# EasyEDA schematic Bravo-M6-LED Board.json

## Sheets
1 Bravo-M6-LED Board: TITLE: Bravo V1.0-M6-LED Board; REV: 1.1; Date: 2021-11-23; Sheet: 1/2; Drawn By: Kaveh Majidi (CONFIG IOI)
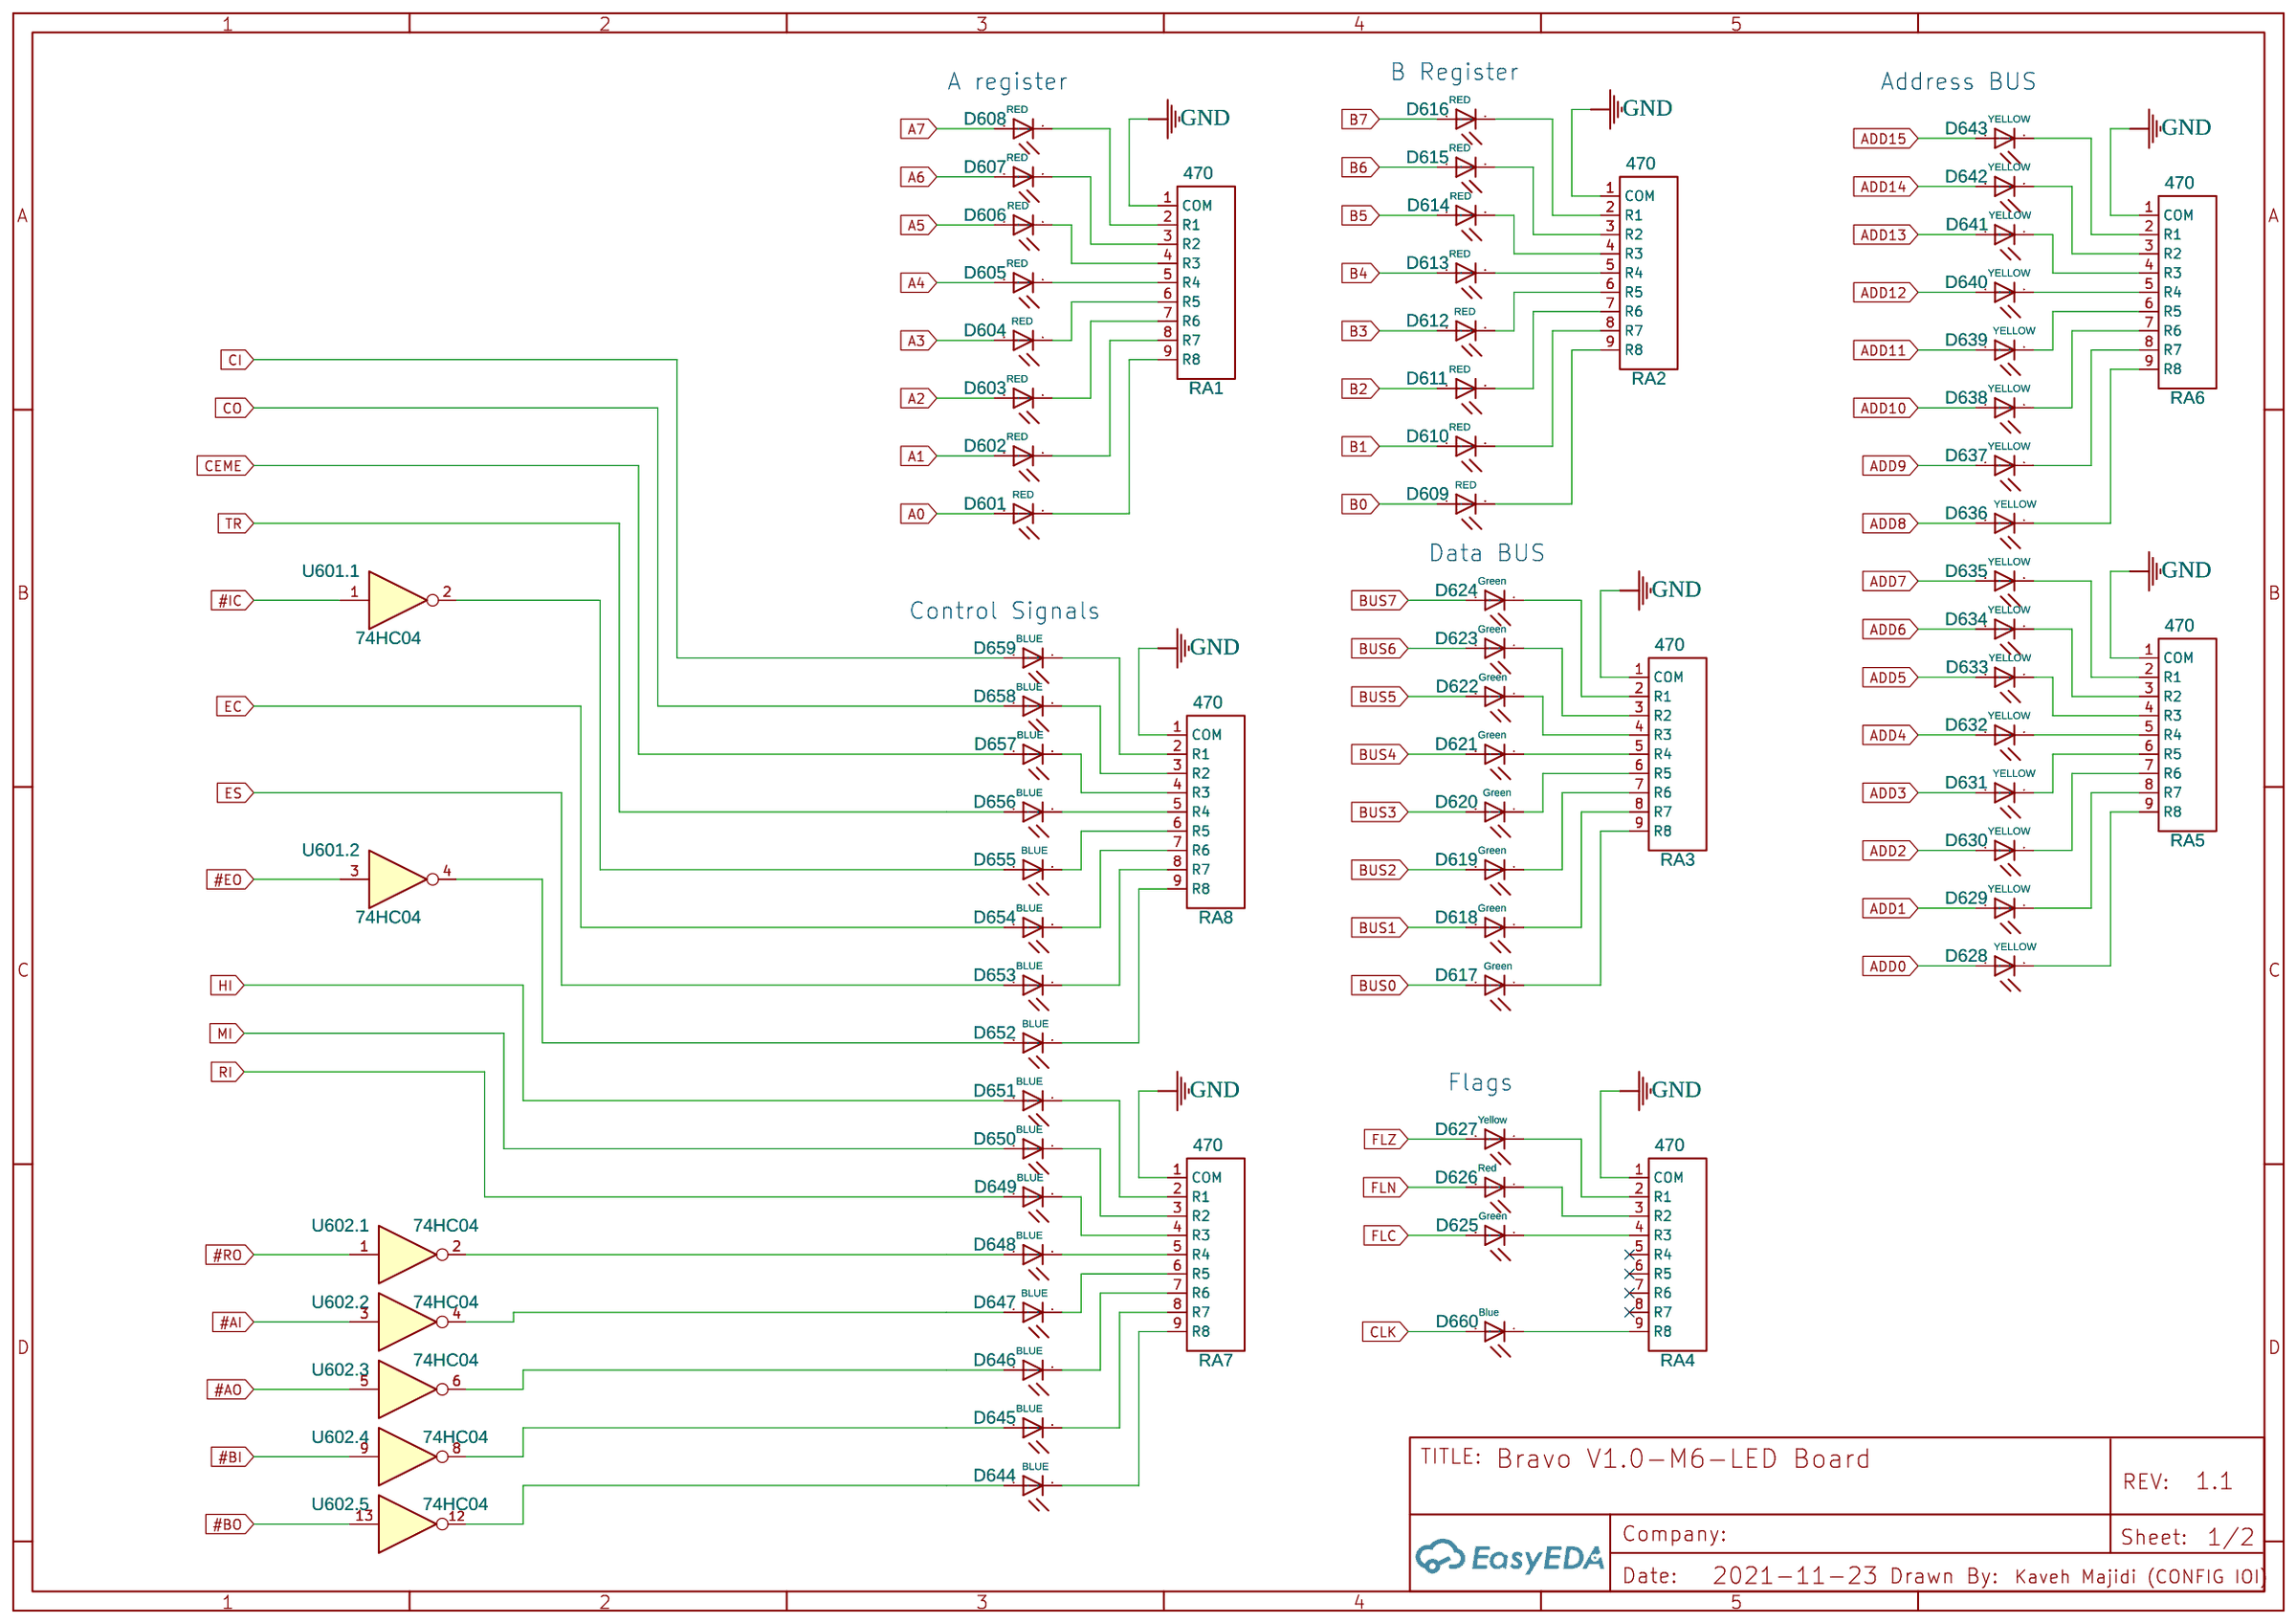
[diagram p0: Bravo-M6-LED Board]
2 Bravo-M6-Common: TITLE: Bravo V1.0-M6-Common; Sheet: 2/2
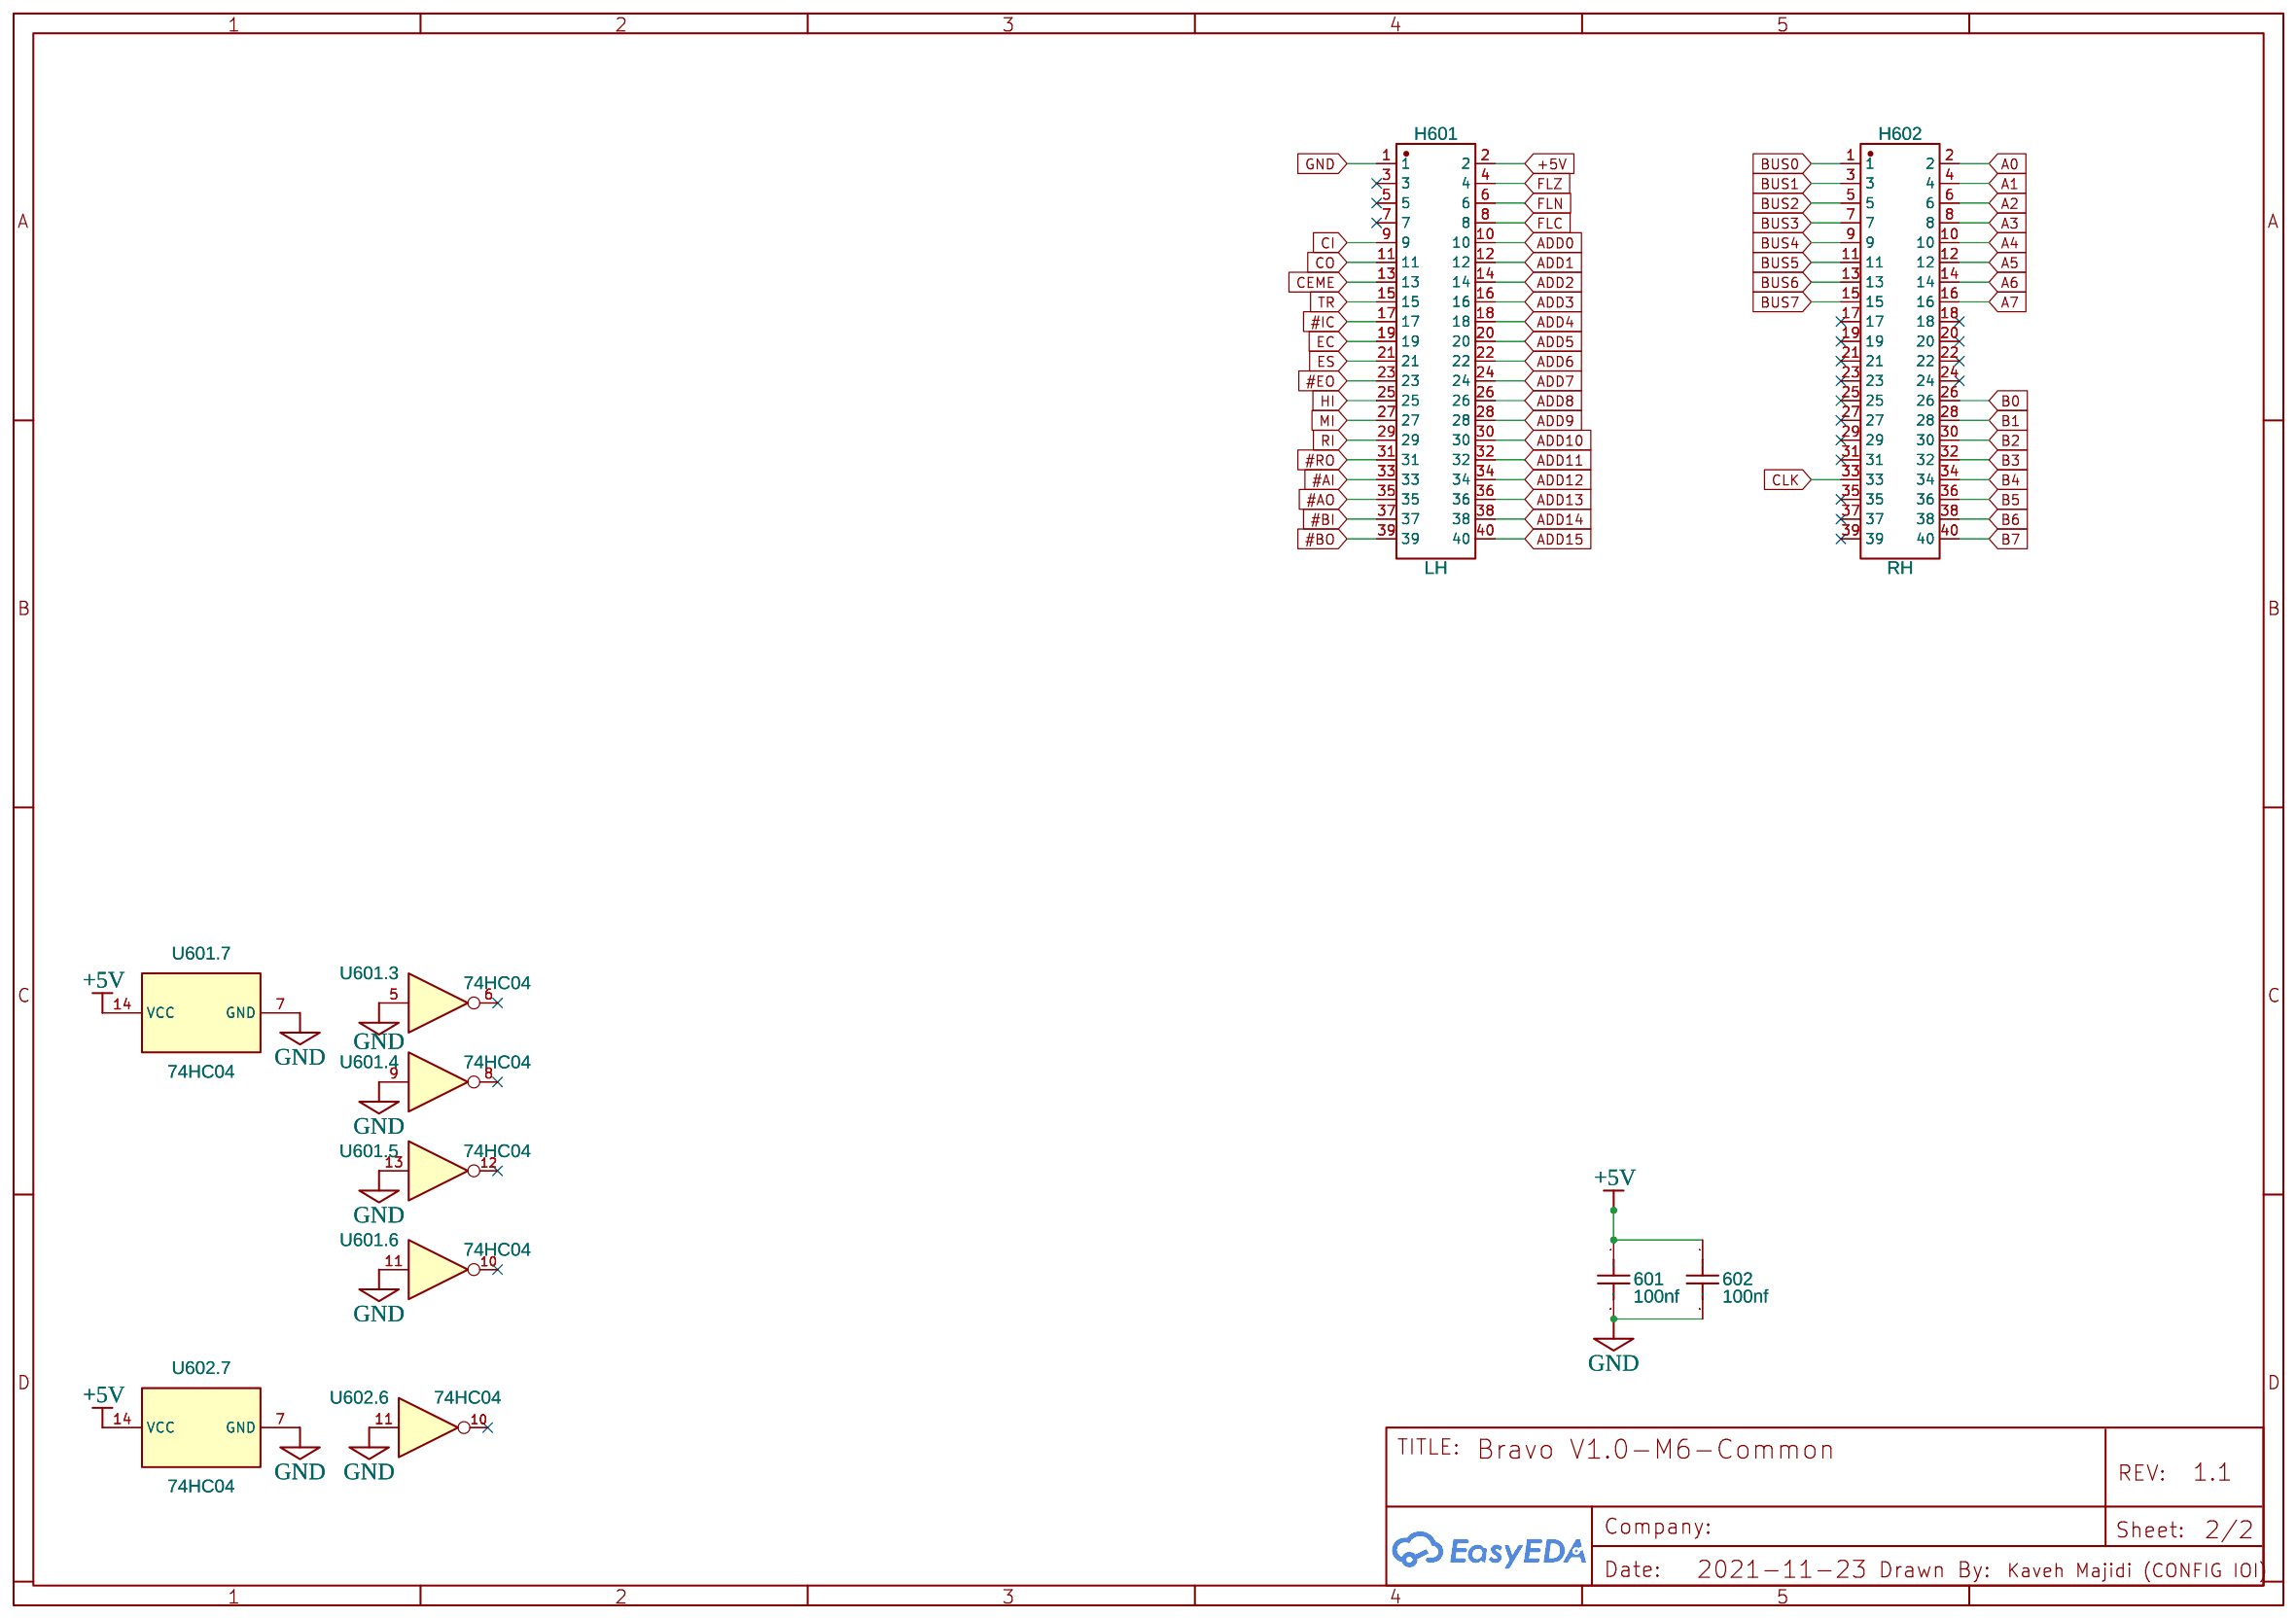
[diagram p1: Bravo-M6-Common]

## Parts
sheet Bravo-M6-Common
601  100nf  [CAP-TH_L4.0-W2.5-P5.00-D1.0]
602  100nf  [CAP-TH_L4.0-W2.5-P5.00-D1.0]
H601  LH  [HEADER-2X20-2.54]
H602  RH  [HEADER-2X20-2.54]
sheet Bravo-M6-LED Board
D601  RED  [LED5MM]
D602  RED  [LED5MM]
D603  RED  [LED5MM]
D604  RED  [LED5MM]
D605  RED  [LED5MM]
D606  RED  [LED5MM]
D607  RED  [LED5MM]
D608  RED  [LED5MM]
D609  RED  [LED5MM]
D610  RED  [LED5MM]
D611  RED  [LED5MM]
D612  RED  [LED5MM]
D613  RED  [LED5MM]
D614  RED  [LED5MM]
D615  RED  [LED5MM]
D616  RED  [LED5MM]
D617  Green  [LED5MM]
D618  Green  [LED5MM]
D619  Green  [LED5MM]
D620  Green  [LED5MM]
D621  Green  [LED5MM]
D622  Green  [LED5MM]
D623  Green  [LED5MM]
D624  Green  [LED5MM]
D625  Green  [LED5MM]
D626  Red  [LED5MM]
D627  Yellow  [LED5MM]
D628  YELLOW  [LED5MM]
D629  YELLOW  [LED5MM]
D630  YELLOW  [LED5MM]
D631  YELLOW  [LED5MM]
D632  YELLOW  [LED5MM]
D633  YELLOW  [LED5MM]
D634  YELLOW  [LED5MM]
D635  YELLOW  [LED5MM]
D636  YELLOW  [LED5MM]
D637  YELLOW  [LED5MM]
D638  YELLOW  [LED5MM]
D639  YELLOW  [LED5MM]
D640  YELLOW  [LED5MM]
D641  YELLOW  [LED5MM]
D642  YELLOW  [LED5MM]
D643  YELLOW  [LED5MM]
D644  BLUE  [LED5MM]
D645  BLUE  [LED5MM]
D646  BLUE  [LED5MM]
D647  BLUE  [LED5MM]
D648  BLUE  [LED5MM]
D649  BLUE  [LED5MM]
D650  BLUE  [LED5MM]
D651  BLUE  [LED5MM]
D652  BLUE  [LED5MM]
D653  BLUE  [LED5MM]
D654  BLUE  [LED5MM]
D655  BLUE  [LED5MM]
D656  BLUE  [LED5MM]
D657  BLUE  [LED5MM]
D658  BLUE  [LED5MM]
D659  BLUE  [LED5MM]
D660  Blue  [LED5MM]
RA1  470  [HDR-M-2.54_1X9]
RA2  470  [HDR-M-2.54_1X9]
RA3  470  [HDR-M-2.54_1X9]
RA4  470  [HDR-M-2.54_1X9]
RA5  470  [HDR-M-2.54_1X9]
RA6  470  [HDR-M-2.54_1X9]
RA7  470  [HDR-M-2.54_1X9]
RA8  470  [HDR-M-2.54_1X9]
U601  74HC04  [DIP-14_W7.62MM_SOCKET]  (sections 1,2,3,4,5,6,7)
U602  74HC04  [DIP-14_W7.62MM_SOCKET]  (sections 1,2,3,4,5,6,7)

## Library data of the parts
601 602 = CC45SL3AD220JYVNA: Supplier: LCSC; Supplier Part: C342429; Manufacturer: TDK; Contributor: LCSC
H601 H602 = HEADER-2x20-2.54: Manufacturer Part: Headers  Pins2.54mm1*10P; image: http://image.lceda.cn/szlcsc/C57369.jpg; Supplier Part: C57369; Contributor: panasonic-spunt
D601-D660 = LED5MM: LEDs; Contributor: Pinoccio
RA1-RA8 = Resistor Array 8: Contributor: shubhankar1991
U601 U602 = 74HC04: Contributor: drividian; subpart_no: 1

## Nets
+5V: 601.1 602.1 H601.2 U601.14(VCC) U602.14(VCC)
GND: 601.2 602.2 H601.1 RA1.1(COM) RA2.1(COM) RA3.1(COM) RA4.1(COM) RA5.1(COM) RA6.1(COM) RA7.1(COM) RA8.1(COM) U601.5 U601.7(GND) U601.9 U601.11 U601.13 U602.7(GND) U602.11
#AI: H601.33 U602.3
#AO: H601.35 U602.5
#BI: H601.37 U602.9
#BO: H601.39 U602.13
#EO: H601.23 U601.3
#IC: H601.17 U601.1
#RO: H601.31 U602.1
A0: D601.A H602.2
A1: D602.A H602.4
A2: D603.A H602.6
A3: D604.A H602.8
A4: D605.A H602.10
A5: D606.A H602.12
A6: D607.A H602.14
A7: D608.A H602.16
ADD0: D628.A H601.10
ADD1: D629.A H601.12
ADD2: D630.A H601.14
ADD3: D631.A H601.16
ADD4: D632.A H601.18
ADD5: D633.A H601.20
ADD6: D634.A H601.22
ADD7: D635.A H601.24
ADD8: D636.A H601.26
ADD9: D637.A H601.28
ADD10: D638.A H601.30
ADD11: D639.A H601.32
ADD12: D640.A H601.34
ADD13: D641.A H601.36
ADD14: D642.A H601.38
ADD15: D643.A H601.40
B0: D609.A H602.26
B1: D610.A H602.28
B2: D611.A H602.30
B3: D612.A H602.32
B4: D613.A H602.34
B5: D614.A H602.36
B6: D615.A H602.38
B7: D616.A H602.40
BUS0: D617.A H602.1
BUS1: D618.A H602.3
BUS2: D619.A H602.5
BUS3: D620.A H602.7
BUS4: D621.A H602.9
BUS5: D622.A H602.11
BUS6: D623.A H602.13
BUS7: D624.A H602.15
CEME: D657.A H601.13
CI: D659.A H601.9
CLK: D660.A H602.33
CO: D658.A H601.11
EC: D654.A H601.19
ES: D653.A H601.21
FLC: D625.A H601.8
FLN: D626.A H601.6
FLZ: D627.A H601.4
HI: D651.A H601.25
MI: D650.A H601.27
RI: D649.A H601.29
TR: D656.A H601.15
Net-(D601-K): D601.K(C) RA1.9(R8)
Net-(D602-K): D602.K(C) RA1.8(R7)
Net-(D603-K): D603.K(C) RA1.7(R6)
Net-(D604-K): D604.K(C) RA1.6(R5)
Net-(D605-K): D605.K(C) RA1.5(R4)
Net-(D606-K): D606.K(C) RA1.4(R3)
Net-(D607-K): D607.K(C) RA1.3(R2)
Net-(D608-K): D608.K(C) RA1.2(R1)
Net-(D609-K): D609.K(C) RA2.9(R8)
Net-(D610-K): D610.K(C) RA2.8(R7)
Net-(D611-K): D611.K(C) RA2.7(R6)
Net-(D612-K): D612.K(C) RA2.6(R5)
Net-(D613-K): D613.K(C) RA2.5(R4)
Net-(D614-K): D614.K(C) RA2.4(R3)
Net-(D615-K): D615.K(C) RA2.3(R2)
Net-(D616-K): D616.K(C) RA2.2(R1)
Net-(D617-K): D617.K(C) RA3.9(R8)
Net-(D618-K): D618.K(C) RA3.8(R7)
Net-(D619-K): D619.K(C) RA3.7(R6)
Net-(D620-K): D620.K(C) RA3.6(R5)
Net-(D621-K): D621.K(C) RA3.5(R4)
Net-(D622-K): D622.K(C) RA3.4(R3)
Net-(D623-K): D623.K(C) RA3.3(R2)
Net-(D624-K): D624.K(C) RA3.2(R1)
Net-(D625-K): D625.K(C) RA4.4(R3)
Net-(D626-K): D626.K(C) RA4.3(R2)
Net-(D627-K): D627.K(C) RA4.2(R1)
Net-(D628-K): D628.K(C) RA5.9(R8)
Net-(D629-K): D629.K(C) RA5.8(R7)
Net-(D630-K): D630.K(C) RA5.7(R6)
Net-(D631-K): D631.K(C) RA5.6(R5)
Net-(D632-K): D632.K(C) RA5.5(R4)
Net-(D633-K): D633.K(C) RA5.4(R3)
Net-(D634-K): D634.K(C) RA5.3(R2)
Net-(D635-K): D635.K(C) RA5.2(R1)
Net-(D636-K): D636.K(C) RA6.9(R8)
Net-(D637-K): D637.K(C) RA6.8(R7)
Net-(D638-K): D638.K(C) RA6.7(R6)
Net-(D639-K): D639.K(C) RA6.6(R5)
Net-(D640-K): D640.K(C) RA6.5(R4)
Net-(D641-K): D641.K(C) RA6.4(R3)
Net-(D642-K): D642.K(C) RA6.3(R2)
Net-(D643-K): D643.K(C) RA6.2(R1)
Net-(D644-A): D644.A U602.12
Net-(D644-K): D644.K(C) RA7.9(R8)
Net-(D645-A): D645.A U602.8
Net-(D645-K): D645.K(C) RA7.8(R7)
Net-(D646-A): D646.A U602.6
Net-(D646-K): D646.K(C) RA7.7(R6)
Net-(D647-A): D647.A U602.4
Net-(D647-K): D647.K(C) RA7.6(R5)
Net-(D648-A): D648.A U602.2
Net-(D648-K): D648.K(C) RA7.5(R4)
Net-(D649-K): D649.K(C) RA7.4(R3)
Net-(D650-K): D650.K(C) RA7.3(R2)
Net-(D651-K): D651.K(C) RA7.2(R1)
Net-(D652-A): D652.A U601.4
Net-(D652-K): D652.K(C) RA8.9(R8)
Net-(D653-K): D653.K(C) RA8.8(R7)
Net-(D654-K): D654.K(C) RA8.7(R6)
Net-(D655-A): D655.A U601.2
Net-(D655-K): D655.K(C) RA8.6(R5)
Net-(D656-K): D656.K(C) RA8.5(R4)
Net-(D657-K): D657.K(C) RA8.4(R3)
Net-(D658-K): D658.K(C) RA8.3(R2)
Net-(D659-K): D659.K(C) RA8.2(R1)
Net-(D660-K): D660.K(C) RA4.9(R8)

Not connected (* = marked no-connect by the designer): H601 3* 5* 7*; H602 17* 18* 19* 20* 21* 22* 23* 24* 25* 27* 29* 31* 35* 37* 39*; RA4 5(R4)* 6(R5)* 7(R6)* 8(R7)*; U601 6* 8* 10* 12*; U602 10*

## Notes on the sheets
sheet 1
- B Register
- A register
- Address BUS
- Data BUS
- Control Signals
- Flags
